# Altium schematic sheet GPS.SchDoc
size A4
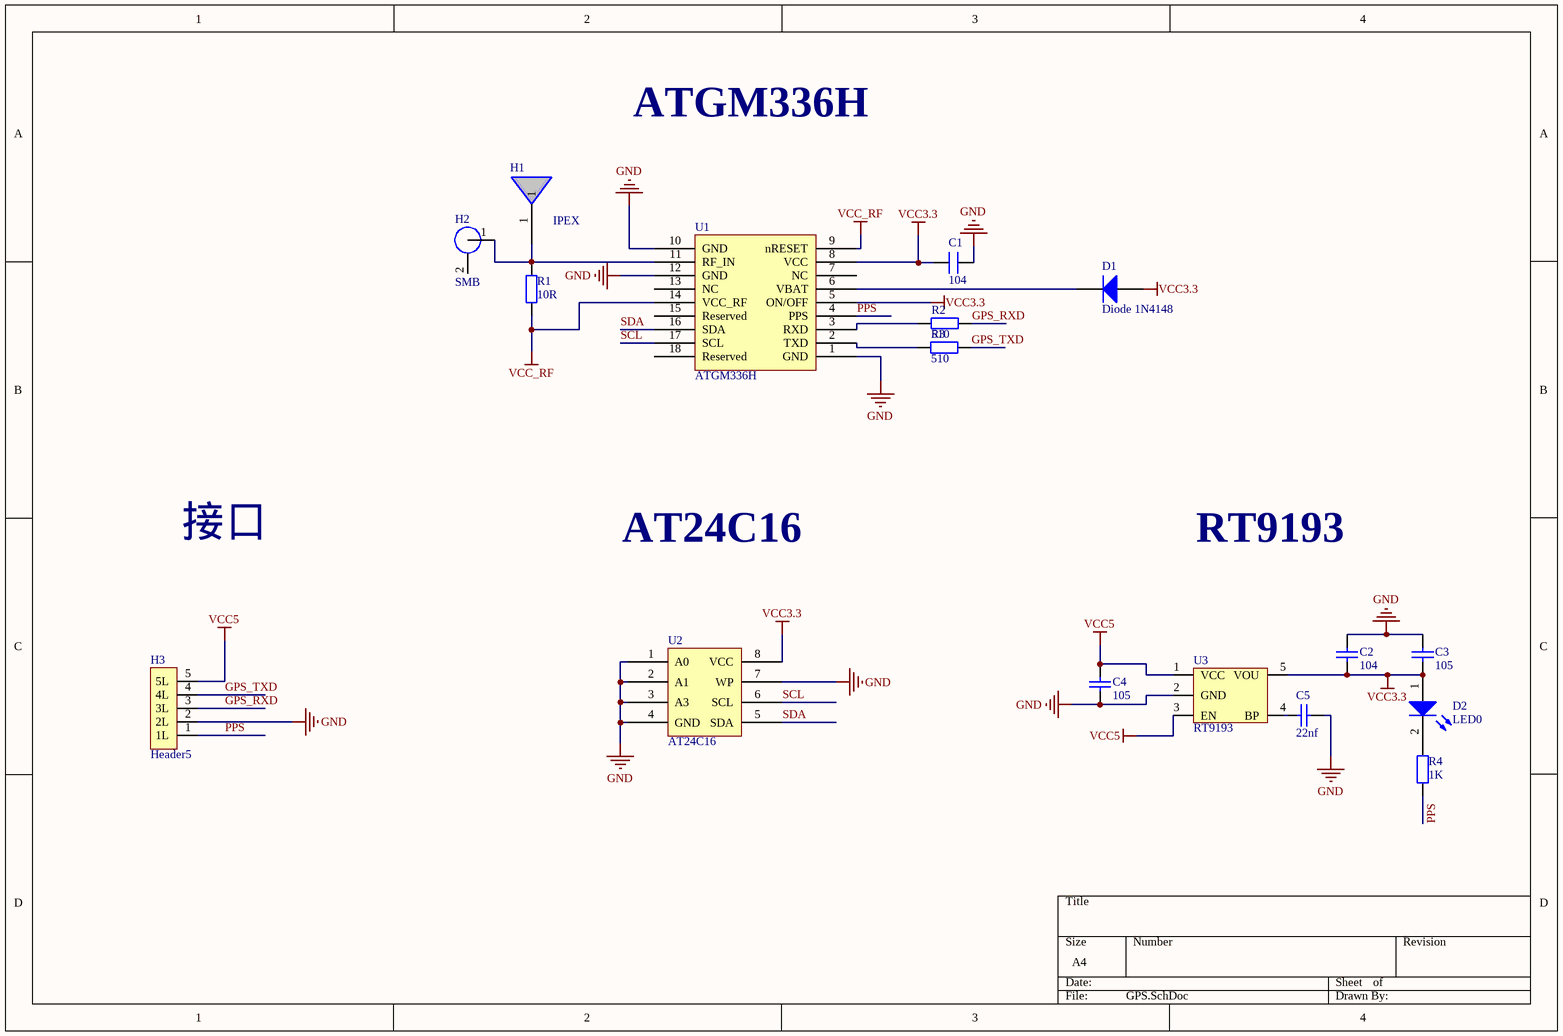
[diagram p0: GPS.SchDoc]

## Parts
C1  104  [0805C]
C2  104  [0805C]
C3  105  [0805C]
C4  105  [0805C]
C5  22nf  [0805C]
D1  Diode 1N4148  [DO-35]
D2  LED0  [LED_0805_B]
H1  IPEX
H2  SMB
H3  Header5
R1  10R  [0805R]
R2  510  [0805R]
R3  510  [0805R]
R4  1K  [0805R]
U1  ATGM336H
U2  AT24C16
U3  RT9193

## Nets
GND: C1.1 C2.1 C3.2 C4.1 C5.2 H3.2(2L) U1.1(GND) U1.10(GND) U1.12(GND) U2.1(A0) U2.2(A1) U2.3(A3) U2.4(GND) U2.7(WP) U3.2(GND)
VCC3.3: C1.2 C2.2 C3.1 D1.1(A) D2.1(A) U1.5(ON/OFF) U1.8(VCC) U2.8(VCC) U3.5(VOU)
VCC5: C4.2 H3.5(5L) U3.1(VCC) U3.3(EN)
VCC_RF: R1.1 U1.9(nRESET) U1.14(VCC_RF)
GPS_RXD: H3.3(3L) R2.2
GPS_TXD: H3.4(4L) R3.2
PPS: H3.1(1L) R4.2 U1.4(PPS)
SCL: U1.17(SCL) U2.6(SCL)
SDA: U1.16(SDA) U2.5(SDA)
NetC5_1: C5.1 U3.4(BP)
NetD1_2: D1.2(K) U1.6(VBAT)
NetD2_2: D2.2(K) R4.1
NetH1_1: H1.1 H2.1 R1.2 U1.11(RF_IN)
NetR2_1: R2.1 U1.3(RXD)
NetR3_1: R3.1 U1.2(TXD)

Not connected (* = marked no-connect by the designer): H2 2; U1 7(NC) 13(NC) 15(Reserved) 18(Reserved)

## Notes on the sheet
- ATGM336H
- 接口
- AT24C16
- RT9193

## Library data of the parts
C1 = C
C2-C5 = Cap: Capacitor; Value: 0.1uf; Published: 8-Jun-2000; LatestRevisionDate: 17-Jul-2002; LatestRevisionNote: Re-released for DXP Platform.; PackageReference: RAD-0.3; Publisher: Altium Limited; PackageDescription: Radial Cap, Thru-Hole; 2 Leads; 0.3 in Pin Spacing
D1 = Diode 1N4148: High Conductance Fast Diode; Published: 8-Jun-2000; LatestRevisionDate: 17-Jul-2002; LatestRevisionNote: Re-released for DXP Platform.; DatasheetVersion: 1997; PackageReference: DO-35; Publisher: Altium Limited; PackageDescription: Diode, Axial; Body 3.8 x 1.9 mm (LxDia. max), Lead Dia. 0.53 mm (max); Code_JEDEC: DO-204-AH; ComponentLink1Description: Manufacturer Link; ComponentLink1URL: http://www.fairchildsemi.com/; ComponentLink2Description: Datasheet; ComponentLink2URL: http://www.fairchildsemi.com/ds/1N%2F1N4148.pdf
D2 = LED0: Typical INFRARED GaAs LED; Published: 8-Jun-2000; LatestRevisionDate: 08-Jul-2005; LatestRevisionNote: Mech Layer 1 removed.; PackageReference: LED-0; Publisher: Altium Limited; PackageDescription: LED; 2 Leads
H1 = IPEX: 天线座子
H2 = SMB: 天线座子
H3 = Header5: 5P接线
R1-R4 = Res2: Resistor; Manufacturer: Generic Components; Class: Passive; Value: 330; Published: 08/06/2000; Publisher: Altium Hobart Technology Centre; SubClass: Resistor
U1 = ATGM336H: GPS芯片
U2 = AT24C16: EEPROM
U3 = RT9193: 稳压芯片